# Altium schematic sheet shock.SchDoc
size Letter
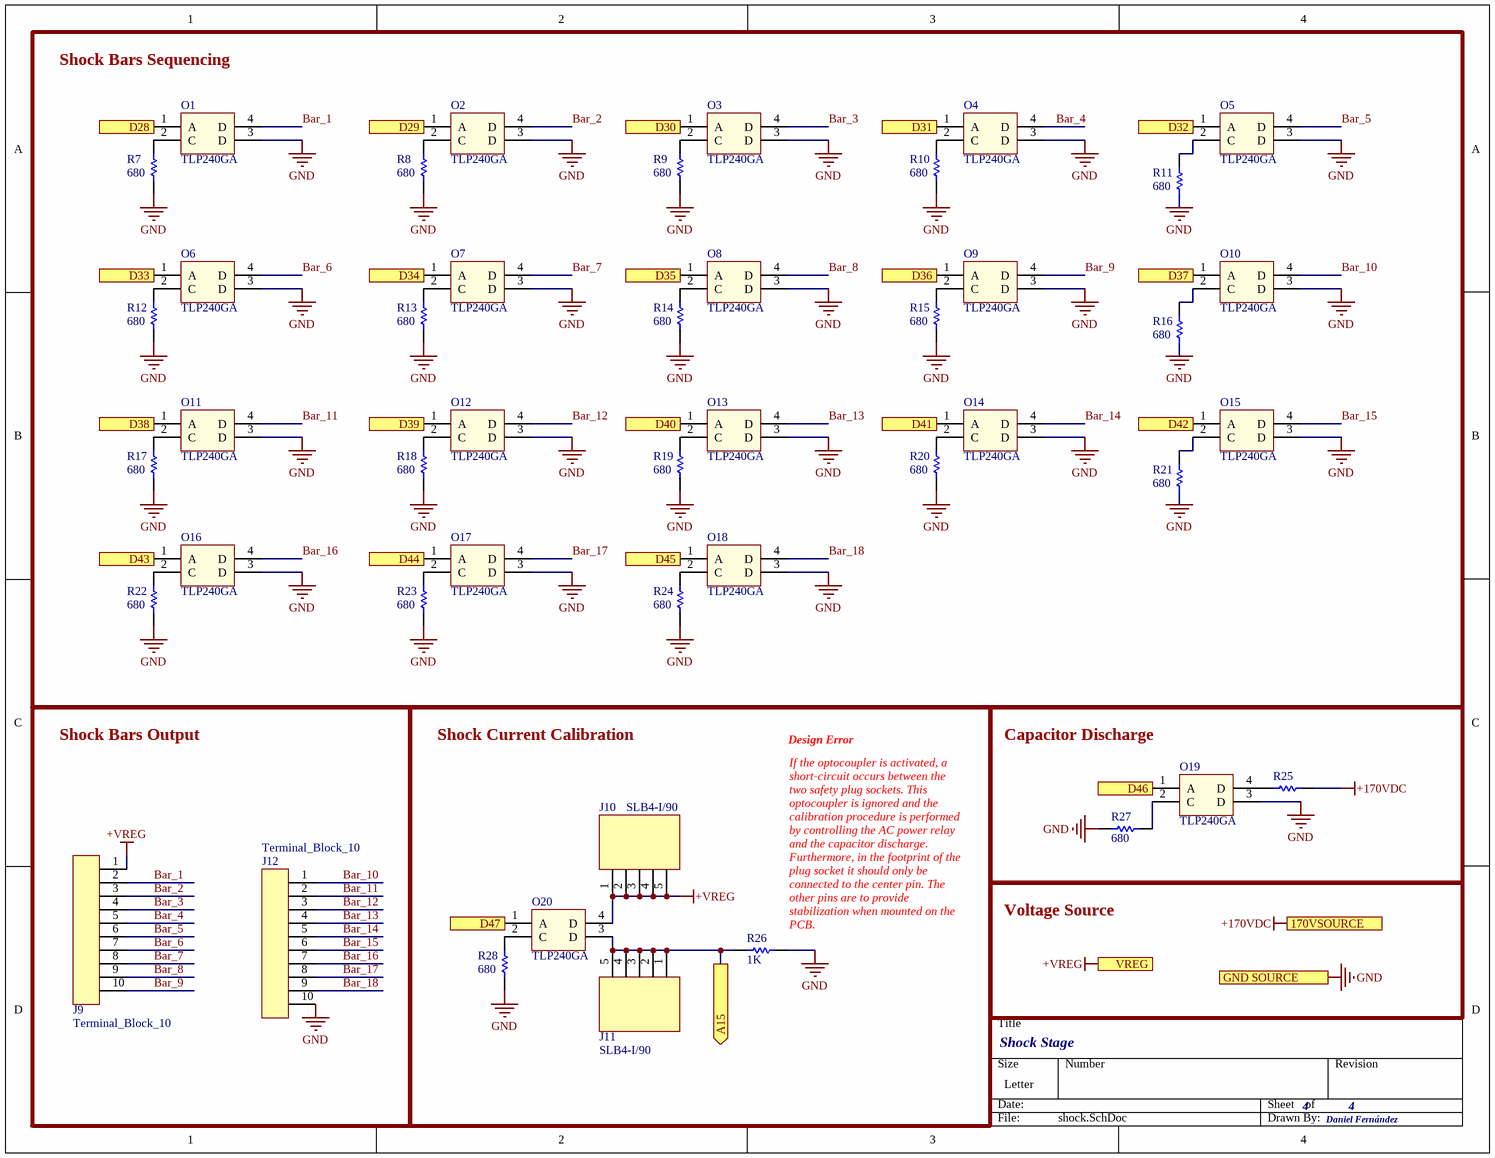
[diagram p0: shock.SchDoc]

## Parts
J9  Terminal_Block_10  [Terminal_Block_10]
J10  SLB4-I/90  [SLB4-I/90]
J11  SLB4-I/90  [SLB4-I/90]
J12  Terminal_Block_10  [Terminal_Block_10]
O1  TLP240GA  [TLP240GA]
O2  TLP240GA  [TLP240GA]
O3  TLP240GA  [TLP240GA]
O4  TLP240GA  [TLP240GA]
O5  TLP240GA  [TLP240GA]
O6  TLP240GA  [TLP240GA]
O7  TLP240GA  [TLP240GA]
O8  TLP240GA  [TLP240GA]
O9  TLP240GA  [TLP240GA]
O10  TLP240GA  [TLP240GA]
O11  TLP240GA  [TLP240GA]
O12  TLP240GA  [TLP240GA]
O13  TLP240GA  [TLP240GA]
O14  TLP240GA  [TLP240GA]
O15  TLP240GA  [TLP240GA]
O16  TLP240GA  [TLP240GA]
O17  TLP240GA  [TLP240GA]
O18  TLP240GA  [TLP240GA]
O19  TLP240GA  [TLP240GA]
O20  TLP240GA  [TLP240GA]
R7  680  [RESISTOR]
R8  680  [RESISTOR]
R9  680  [RESISTOR]
R10  680  [RESISTOR]
R11  680  [RESISTOR]
R12  680  [RESISTOR]
R13  680  [RESISTOR]
R14  680  [RESISTOR]
R15  680  [RESISTOR]
R16  680  [RESISTOR]
R17  680  [RESISTOR]
R18  680  [RESISTOR]
R19  680  [RESISTOR]
R20  680  [RESISTOR]
R21  680  [RESISTOR]
R22  680  [RESISTOR]
R23  680  [RESISTOR]
R24  680  [RESISTOR]
R25  Ceramic Resistor  [AXIAL_CERAMIC_RESISTOR]  (value not drawn)
R26  1K  [RESISTOR]
R27  680  [RESISTOR]
R28  680  [RESISTOR]

## Blocks framed on the sheet
Shock Bars Sequencing: O1-O18 R7-R24
Shock Bars Output: J9 J12
Shock Current Calibration: J10 J11 O20 R26 R28
Capacitor Discharge: O19 R25 R27

## Ports
170VSOURCE (in), A15 (out), D28 (in), D29 (in), D30 (in), D31 (in), D32 (in), D33 (in), D34 (in), D35 (in), D36 (in), D37 (in), D38 (in), D39 (in), D40 (in), D41 (in), D42 (in), D43 (in), D44 (in), D45 (in), D46 (in), D47 (in), GND SOURCE (in), VREG (in)

## Nets
+170VDC: R25.2 ; port 170VSOURCE
+VREG: J9.1 J10.1 J10.2(Vin) J10.3(Vin) J10.4(Vin) J10.5(Vin) O20.4(D) ; port VREG
GND: J12.10 O1.3(D) O2.3(D) O3.3(D) O4.3(D) O5.3(D) O6.3(D) O7.3(D) O8.3(D) O9.3(D) O10.3(D) O11.3(D) O12.3(D) O13.3(D) O14.3(D) O15.3(D) O16.3(D) O17.3(D) O18.3(D) O19.3(D) R7.1 R8.1 R9.1 R10.1 R11.1 R12.1 R13.1 R14.1 R15.1 R16.1 R17.1 R18.1 R19.1 R20.1 R21.1 R22.1 R23.1 R24.1 R26.2 R27.1 R28.1 ; port GND SOURCE
A15: J11.1 J11.2(Vin) J11.3(Vin) J11.4(Vin) J11.5(Vin) O20.3(D) R26.1 ; port A15
Bar_1: J9.2 O1.4(D)
Bar_2: J9.3 O2.4(D)
Bar_3: J9.4 O3.4(D)
Bar_4: J9.5 O4.4(D)
Bar_5: J9.6 O5.4(D)
Bar_6: J9.7 O6.4(D)
Bar_7: J9.8 O7.4(D)
Bar_8: J9.9 O8.4(D)
Bar_9: J9.10 O9.4(D)
Bar_10: J12.1 O10.4(D)
Bar_11: J12.2 O11.4(D)
Bar_12: J12.3 O12.4(D)
Bar_13: J12.4 O13.4(D)
Bar_14: J12.5 O14.4(D)
Bar_15: J12.6 O15.4(D)
Bar_16: J12.7 O16.4(D)
Bar_17: J12.8 O17.4(D)
Bar_18: J12.9 O18.4(D)
D28: O1.1(A) ; port D28
D29: O2.1(A) ; port D29
D30: O3.1(A) ; port D30
D31: O4.1(A) ; port D31
D32: O5.1(A) ; port D32
D33: O6.1(A) ; port D33
D34: O7.1(A) ; port D34
D35: O8.1(A) ; port D35
D36: O9.1(A) ; port D36
D37: O10.1(A) ; port D37
D38: O11.1(A) ; port D38
D39: O12.1(A) ; port D39
D40: O13.1(A) ; port D40
D41: O14.1(A) ; port D41
D42: O15.1(A) ; port D42
D43: O16.1(A) ; port D43
D44: O17.1(A) ; port D44
D45: O18.1(A) ; port D45
D46: O19.1(A) ; port D46
D47: O20.1(A) ; port D47
NetO1_2: O1.2(C) R7.2
NetO2_2: O2.2(C) R8.2
NetO3_2: O3.2(C) R9.2
NetO4_2: O4.2(C) R10.2
NetO5_2: O5.2(C) R11.2
NetO6_2: O6.2(C) R12.2
NetO7_2: O7.2(C) R13.2
NetO8_2: O8.2(C) R14.2
NetO9_2: O9.2(C) R15.2
NetO10_2: O10.2(C) R16.2
NetO11_2: O11.2(C) R17.2
NetO12_2: O12.2(C) R18.2
NetO13_2: O13.2(C) R19.2
NetO14_2: O14.2(C) R20.2
NetO15_2: O15.2(C) R21.2
NetO16_2: O16.2(C) R22.2
NetO17_2: O17.2(C) R23.2
NetO18_2: O18.2(C) R24.2
NetO19_2: O19.2(C) R27.2
NetO19_4: O19.4(D) R25.1
NetO20_2: O20.2(C) R28.2

## Notes on the sheet
- Design Error
- Voltage Source
- (near R26) If the optocoupler is activated, a short-circuit occurs between the two safety plug sockets. This optocoupler is ignored and the calibration procedure is performed by controlling the AC power relay and the capacitor discharge. Furthermore, in the footprint of the plug socket it should only be connected to the center pin. The other pins are to provide stabilization when mounted on the PCB.
- Shock Stage
- 4
- Daniel Fernández
- Title
- Size:
- Date:
- Letter
- Number:
- Time:
- Revision:
- Sheet
- of
- File:

## Library data of the parts
O1-O20 = TLP240GA: Photorelay
R7-R24 R26-R28 = Resistor_Axial: Published: 8-Jun-2000; LatestRevisionDate: 17-Jul-2002; LatestRevisionNote: Re-released for DXP Platform.; PackageReference: AXIAL-0.3; Publisher: Altium Limited; PackageDescription: Axial Device, Thru-Hole; 2 Leads; 0.3 in Pin Spacing
R25 = AXIAL_CERAMIC_RESISTOR